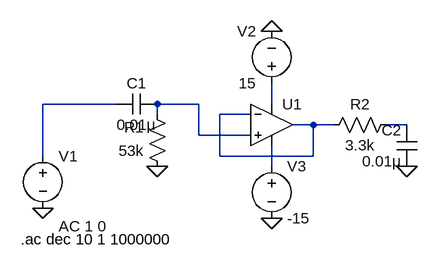
[diagram p0: schematic Lab7BP.asc]
Lab7BP.asc, the LTspice schematic file:
Version 4
SHEET 1 880 680
WIRE 16 80 -96 80
WIRE 144 80 80 80
WIRE 256 80 256 48
WIRE 80 96 80 80
WIRE 224 96 176 96
WIRE 320 112 288 112
WIRE 352 112 320 112
WIRE 464 112 432 112
WIRE 144 128 144 80
WIRE 224 128 144 128
WIRE -96 160 -96 80
WIRE 176 160 176 96
WIRE 320 160 320 112
WIRE 320 160 176 160
WIRE 256 176 256 144
FLAG 464 176 0
FLAG 256 256 0
FLAG 256 -32 0
FLAG -96 240 0
FLAG 80 176 0
SYMBOL voltage -96 144 R0
WINDOW 123 24 124 Left 2
WINDOW 39 0 0 Left 0
SYMATTR InstName V1
SYMATTR Value ""
SYMATTR Value2 AC 1 0
SYMBOL voltage 256 64 R180
WINDOW 0 24 96 Left 2
WINDOW 3 24 16 Left 2
WINDOW 123 0 0 Left 0
WINDOW 39 0 0 Left 0
SYMATTR InstName V2
SYMATTR Value 15
SYMBOL voltage 256 160 R0
WINDOW 123 0 0 Left 0
WINDOW 39 0 0 Left 0
SYMATTR InstName V3
SYMATTR Value -15
SYMBOL OpAmps\\UniversalOpAmp 256 112 R0
SYMATTR InstName U1
SYMBOL res 96 192 R180
WINDOW 0 36 76 Left 2
WINDOW 3 36 40 Left 2
SYMATTR InstName R1
SYMATTR Value 53k
SYMBOL res 448 96 R90
WINDOW 0 0 56 VBottom 2
WINDOW 3 32 56 VTop 2
SYMATTR InstName R2
SYMATTR Value 3.3k
SYMBOL cap 80 64 R90
WINDOW 0 0 32 VBottom 2
WINDOW 3 32 32 VTop 2
SYMATTR InstName C1
SYMATTR Value 0.01μ
SYMBOL cap 480 176 R180
WINDOW 0 24 56 Left 2
WINDOW 3 24 8 Left 2
SYMATTR InstName C2
SYMATTR Value 0.01μ
TEXT -130 288 Left 2 !.ac dec 10 1 1000000

The netlist it stands for:
* Lab7BP.asc
V1 N001 0 AC 1 0
V2 N003 0 15
V3 N006 0 -15
XU1 N002 N004 N003 N006 N004 level1 Avol=1Meg GBW=10Meg Vos=0 En=0 Enk=0 In=0 Ink=0 Rin=500Meg  ; pins In+ In- V+ V- OUT
R1 0 N002 53k
R2 N005 N004 3.3k
C1 N002 N001 0.01μ
C2 0 N005 0.01μ
.ac dec 10 1 1000000
.lib UniversalOpAmp1.lib
.backanno
.end